# Altium schematic sheet OPA2342.SchDoc
size A4; SheetNumber: 3; SheetTotal: 3
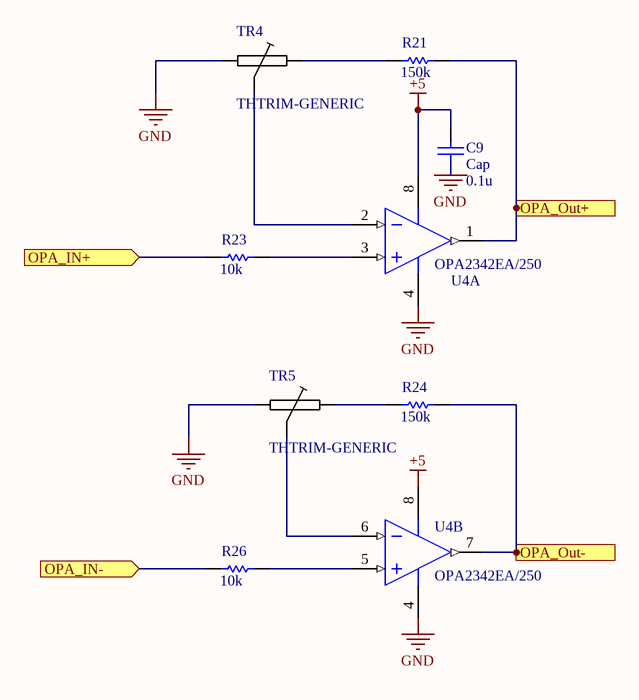
[diagram p0: OPA2342.SchDoc]

## Parts
C9  Cap  value 0.1u  [C1206]
R21  150k  [RESC3216X89X51LL25T25]
R23  10k  [RESC3216X89X51LL25T25]
R24  150k  [RESC3216X89X51LL25T25]
R26  10k  [RESC3216X89X51LL25T25]
TR4  THTRIM-GENERIC  [TRIMMER-MT]
TR5  THTRIM-GENERIC  [TRIMMER-MT]
U4  OPA2342EA/250  [DGK0008A_M]  (parts A,B of 2)

## Ports
OPA_IN+ (in), OPA_IN- (in), OPA_Out+ (out), OPA_Out- (out)

## Nets
+5: C9.1 U4.8(V+)
GND: C9.2 TR4.1 TR5.1 U4.4(V-)
OPA_IN+: R23.2 ; port OPA_IN+
OPA_IN-: R26.2 ; port OPA_IN-
OPA_Out+: R21.1 U4.1(OUT_A) ; port OPA_Out+
OPA_Out-: R24.1 U4.7(OUT_B) ; port OPA_Out-
NetR21_2: R21.2 TR4.2
NetR23_1: R23.1 U4.3(IN_A+)
NetR24_2: R24.2 TR5.2
NetR26_1: R26.1 U4.5(IN_B+)
NetTR4_W: TR4.W U4.2(IN_A-)
NetTR5_W: TR5.W U4.6(IN_B-)

## Library data of the parts
C9 = Cap: Capacitor; Published: 8-Jun-2000; LatestRevisionDate: 17-Jul-2002; LatestRevisionNote: Re-released for DXP Platform.; PackageReference: RAD-0.3; Publisher: Altium Limited; PackageDescription: Radial Cap, Thru-Hole; 2 Leads; 0.3 in Pin Spacing
R21 R23 R24 R26 = CMP-2003-04376-1: Part Number: WSLP1206R0500FEA; Manufacturer: Vishay Dale
TR4 TR5 = THTRIM-GENERIC: TRIMMABLE RESISTOR
U4 = CMP-0271-00302-3: Low Cost, Low Power, Rail-to-Rail Operational Amplifier MicroAmplifier(TM) Series, 2.7 to 5.5 V, -40 to 85 degC, 8-pin SOP (DGK8), Green (RoHS & no Sb/Br); Manufacturer: Texas Instruments; IIB(Max)(pA): 10; CMRR(Min)(dB): 74; Iq per channel(Max)(mA): 0.25; Vio (25C)(Max)(mV): 6; Packing: SMALL T&R; Total Supply Voltage(Min)(+5V is 5, +/-5V is 10): 2.7; Number of Channels: 2; GBW(Typ)(MHz): 1; Offset Drift(Typ)(uV/C): 3; Sub Family: Low Input Bias Current Amp (<=10pA), Low Power Amp (<=500uA), Low Supply Voltage Amplifier (<=2.7V), Precision Amplifier; Total Supply Voltage(Max)(+5V is 5, +/-5V is 10): 5.5; Rating: Catalog; DatasheetVersion: SBOS106A; ComponentLink1Description: Manufacturer URL; PartNumber: OPA2342EA/250; ComponentLink2URL: http://www.ti.com/lit/ds/symlink/opa2342.pdf; ComponentLink3Description: Package Specification; PackageReference: DGK0008A; Eco-Plan: Green (RoHS & no Sb/Br); Slew Rate(Typ)(V/us): 1; Code_JEDEC: MO-187; ComponentLink1URL: http://www.ti.com/; ComponentLink3URL: http://www.ti.com/litv/pdf/mpds028d; PackageDescription: 8-Pin Thin Small Outline, Body 3 x 3 mm, Pitch 0.65 mm; PackageVersion: 4073329/E, 05/2006; ComponentLink2Description: Datasheet; Mounting Technology: Surface Mount